# Altium schematic sheet main_slave.SchDoc
size A4
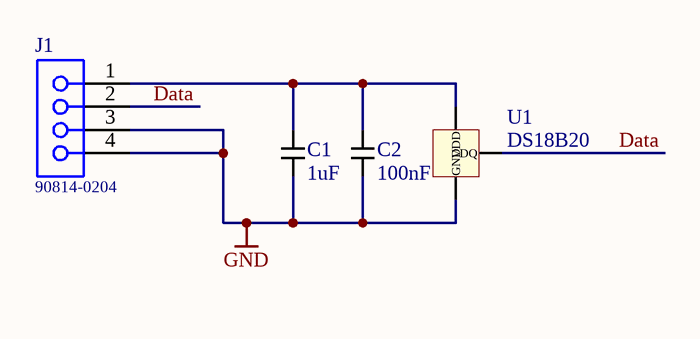
[diagram p0: main_slave.SchDoc]

## Parts
C1  1uF  [C1206]
C2  100nF  [C1206]
J1  90814-0204  [MOLEX_90814-0204]
U1  DS18B20  [TO-92_Twomes]

## Nets
GND: C1.1 C2.1 J1.3 J1.4 U1.1(GND)
Data: J1.2 U1.2(DQ)
NetC1_2: C1.2 C2.2 J1.1 U1.3(VDD)

## Library data of the parts
C1 = 1uF,1206: 1uF, 1206; Capacitance: 1uF; Brand: *; Order Code: *; Type: *
C2 = 100nF,1206: 100nF, 1206; Capacitance: 100nF; Brand: *; Order Code: *; Type: *
J1 = 90814-0204: Pin Header, Signal, 1.27 mm, 1 Rows, 4 Contacts, Surface Mount Straight, Picoflex 90814 Series; Manufacturer: MOLEX; Manufacturer Part Number: 90814-0204
U1 = DS18B20: Temperature Sensor IC, Digital, ± 0.5°C, -55 °C, +125 °C; Brand: MAXIM INTEGRATED PRODUCTS; Type: DS18B20; Farnell_Price: 2,85; Farnell_Order_Code: 2515553; Mouser_Order_Code: 700-DS18B20+; Mouser_Price: 3,97